# EAGLE design working (EAGLE 5.11)
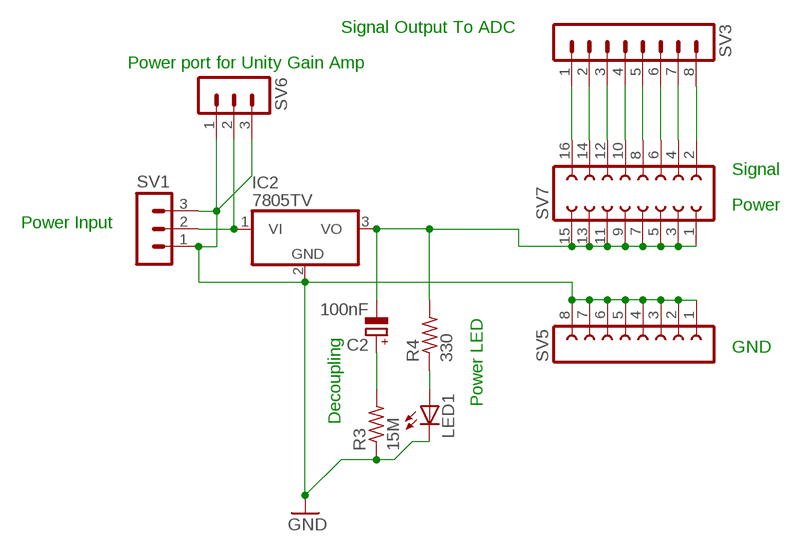
[diagram p0: schematic, sheet 1]

## Parts
C2  100nF  CPOL-EUE1.8-4  [E1,8-4]
IC2  7805TV  [TO220V]
LED1  LED5MM  [LED5MM]
R3  15M  R-US_0207/7  [0207/7]
R4  330  R-US_0207/7  [0207/7]
SV1  MA03-1  [MA03-1]
SV3  MA08-1  [MA08-1]
SV5  FE08-1  [FE08]
SV6  MA03-1  [MA03-1]
SV7  FE08-2  [FE08-2]

## Nets
GND: IC2.2(GND) LED1.K(C) R3.1 SV1.1 SV1.3 SV5.1 SV5.2 SV5.3 SV5.4 SV5.5 SV5.6 SV5.7 SV5.8 SV6.1 SV6.3
N$1: SV3.8 SV7.2
N$2: LED1.A R4.1
N$3: IC2.1(VI) SV1.2 SV6.2
N$4: C2.+ R3.2
N$5: SV3.1 SV7.16
N$6: SV3.2 SV7.14
N$7: SV3.3 SV7.12
N$8: SV3.4 SV7.10
N$9: SV3.5 SV7.8
N$10: SV3.6 SV7.6
N$11: SV3.7 SV7.4
N$13: C2.- IC2.3(VO) R4.2 SV7.1 SV7.3 SV7.5 SV7.7 SV7.9 SV7.11 SV7.13 SV7.15

## Notes on the sheet
- Signal Output To ADC
- Power port for Unity Gain Amp
- Signal
- Power
- Power Input
- GND
- Power LED
- Decoupling

## Library data of the parts
C2 = rcl:CPOL-EU: POLARIZED CAPACITOR, European symbol
IC2 = linear:78*: Positive VOLTAGE REGULATOR Source: http://cache.national.com/ds/LM/LM78L05.pdf http://www.fairchildsemi.com/ds/LM/LM7805.pdf
LED1 = led:LED: LED OSRAM: - CHIPLED LG R971, LG N971, LY N971, LG Q971, LY Q971, LO R971, LY R971 LH N974, LH R974 LS Q976, LO Q976, LY Q976 LO Q996 - Hyper CHIPLED LW Q18S LB Q993, LB Q99A, LB R99A - SideLED LS A670, LO A670, LY A670, LG A670, LP A670 LB A673, LV A673, LT A673, LW A673 LH A674 LY A675 LS A676, LA A676, LO A676, LY A676, LW A676 LS A679, LY A679, LG A679 - Hyper Micro SIDELED® LS Y876, LA Y876, LO Y876, LY Y876 LT Y87S - SmartLED LW L88C, LW L88S LB L89C, LB L89S, LG L890 LS L89K, LO L89K, LY L89K LS L896, LA L896, LO L896, LY L896 - TOPLED LS T670, LO T670, LY T670, LG T670, LP T670 LSG T670, LSP T670, LSY T670, LOP T670, LYG T670 LG T671, LOG T671, LSG T671 LB T673, LV T673, LT T673, LW T673 LH T674 LS T676, LA T676, LO T676, LY T676, LB T676, LH T676, LSB T676, LW T676 LB T67C, LV T67C, LT T67C, LS T67K, LO T67K, LY T67K, LW E67C LS E67B, LA E67B, LO E67B, LY E67B, LB E67C, LV E67C, LT E67C LW T67C LS T679, LY T679, LG T679 LS T770, LO T770, LY T770, LG T770, LP T770 LB T773, LV T773, LT T773, LW T773 LH T774 LS E675, LA E675, LY E675, LS T675 LS T776, LA T776, LO T776, LY T776, LB T776 LHGB T686 LT T68C, LB T68C - Hyper Mini TOPLED® LB M676 - Mini TOPLED Santana® LG M470 LS M47K, LO M47K, LY M47K Source: http://www.osram.convergy.de LUXEON: - LUMILED® LXK2-PW12-R00, LXK2-PW12-S00, LXK2-PW14-U00, LXK2-PW14-V00 LXK2-PM12-R00, LXK2-PM12-S00, LXK2-PM14-U00 LXK2-PE12-Q00, LXK2-PE12-R00, LXK2-PE12-S00, LXK2-PE14-T00, LXK2-PE14-U00 LXK2-PB12-K00, LXK2-PB12-L00, LXK2-PB12-M00, LXK2-PB14-N00, LXK2-PB14-P00, LXK2-PB14-Q00 LXK2-PR12-L00, LXK2-PR12-M00, LXK2-PR14-Q00, LXK2-PR14-R00 LXK2-PD12-Q00, LXK2-PD12-R00, LXK2-PD12-S00 LXK2-PH12-R00, LXK2-PH12-S00 LXK2-PL12-P00, LXK2-PL12-Q00, LXK2-PL12-R00 Source: www.luxeon.com KINGBRIGHT: KA-3528ASYC Source: www.kingbright.com
R3 R4 = resistor:R-US_: RESISTOR, American symbol
SV1 SV6 = con-lstb:MA03-1: PIN HEADER; OC_FARNELL: unknown; OC_NEWARK: unknown
SV3 = con-lstb:MA08-1: PIN HEADER; OC_FARNELL: unknown; OC_NEWARK: unknown
SV5 = con-lsta:FE08-1: FEMALE HEADER; OC_FARNELL: unknown; OC_NEWARK: unknown
SV7 = con-lsta:FE08-2: FEMALE HEADER; OC_FARNELL: unknown; OC_NEWARK: unknown

## Board
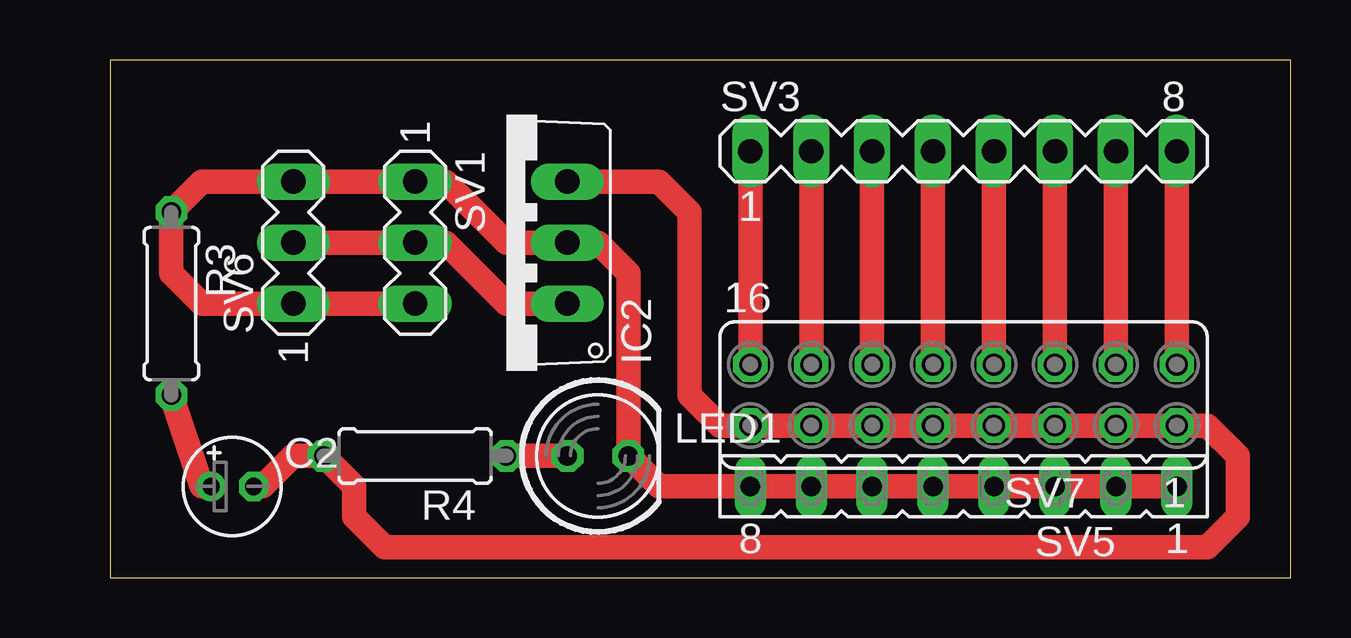
[diagram p1: board, top side]
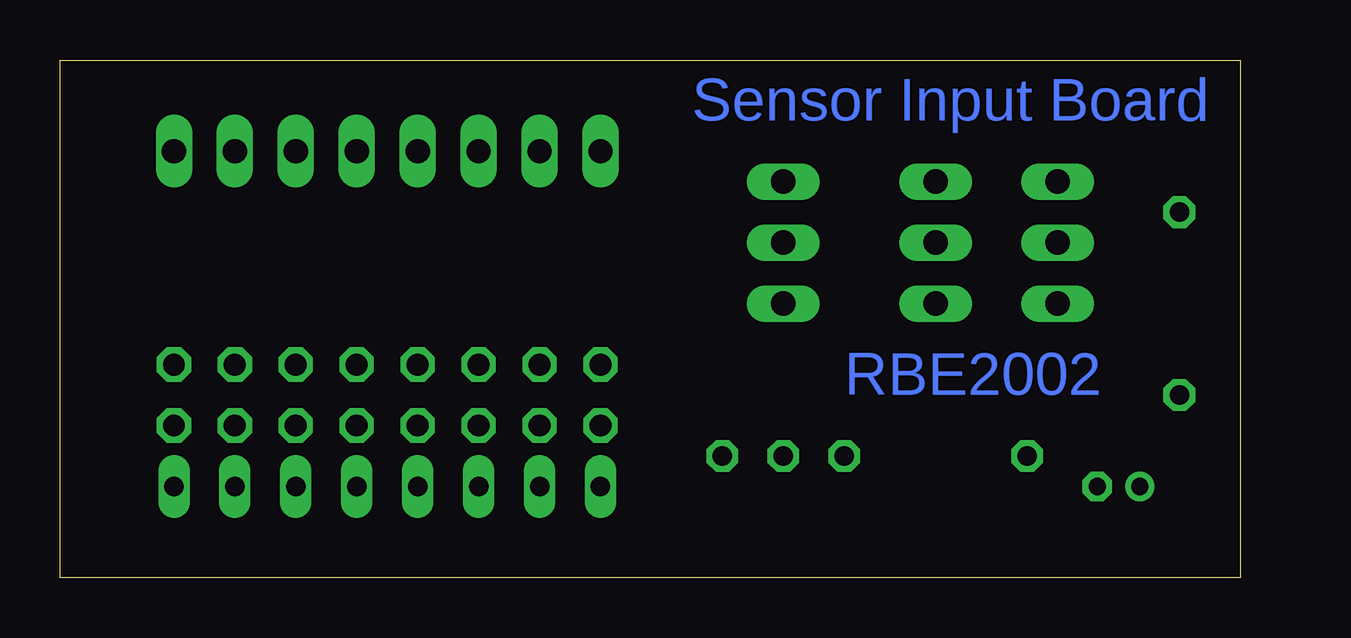
[diagram p2: board, bottom side, seen from below]

Size 49.2 x 21.58 mm. Coordinates in mm from the lower left corner, seen from the top.
Outline: 0,0 49.2,0 49.2,21.58 0,21.58 0,0
Copper layers (1*16): Top 0.035mm / dielectric 1.5mm / Bottom 0.035mm
Design rules "default": minimum track width 10mil, minimum drill 24mil, track to track 8mil, track to pad 8mil, pad to pad 8mil, via to via 8mil, smd to smd 8mil, copper to edge 40mil, drill to drill 8mil, minimum pad ring 10mil, minimum via ring 8mil, stop-mask expansion 4mil, vias tented up to drill 0mil, thermal gap 10mil

### Footprints (pad centres in the part's own frame; a part is rotated, then mirrored left to right if it is on the bottom)
E1,8-4 = drill 0.711 pad 1.168 round: + -0.889,0 | drill 0.711 pad 1.168 octagon: - 0.889,0
TO220V = drill 1.016 long: 1 -2.54,-2.54; 2 0,-2.54; 3 2.54,-2.54
LED5MM = drill 0.813 octagon: A -1.27,0; K 1.27,0
0207/7 = drill 0.813 octagon: 1 -3.81,0; 2 3.81,0
MA03-1 = drill 1.016 long: 1 -2.54,0; 2 0,0; 3 2.54,0
MA08-1 = drill 1.016 long: 1 -8.89,0; 2 -6.35,0; 3 -3.81,0; 4 -1.27,0; 5 1.27,0; 6 3.81,0; 7 6.35,0; 8 8.89,0
FE08 = drill 0.813 long: 1 -8.89,0; 2 -6.35,0; 3 -3.81,0; 4 -1.27,0; 5 1.27,0; 6 3.81,0; 7 6.35,0; 8 8.89,0
FE08-2 = drill 0.914 octagon: 1 -8.89,1.27; 2 -8.89,-1.27; 3 -6.35,1.27; 4 -6.35,-1.27; 5 -3.81,1.27; 6 -3.81,-1.27; 7 -1.27,1.27; 8 -1.27,-1.27; 9 1.27,1.27; 10 1.27,-1.27; 11 3.81,1.27; 12 3.81,-1.27; 13 6.35,1.27; 14 6.35,-1.27; 15 8.89,1.27; 16 8.89,-1.27

### Placement (x,y rotation side)
C2  5.08,3.81 0 top
IC2  16.51,13.97 90 top
LED1  20.32,5.08 0 top
R3  2.54,11.43 270 top
R4  12.7,5.08 180 top
SV1  12.7,13.97 270 top
SV3  35.56,17.78 0 top
SV5  35.56,3.81 180 top
SV6  7.62,13.97 90 top
SV7  35.56,7.62 180 top

### Tracks (layer width: path | path; a pad name or v marks a point on that pad's centre or on a via)
GND
  Top 1.016: SV5.1 SV5.2 SV5.3 SV5.4 SV5.5 SV5.6 SV5.7 SV5.8 22.86,3.81 LED1.K 21.59,12.7 20.32,13.97 IC2.2 16.51,13.97 13.97,16.51 SV1.1 SV6.3 3.81,16.51 R3.1 2.54,12.7 3.81,11.43 SV6.1 SV1.3
N$1
  Top 1.016: SV3.8 SV7.2
N$2
  Top 1.016: R4.1 LED1.A
N$3
  Top 1.016: SV6.2 SV1.2 13.97,13.97 16.51,11.43 IC2.1
N$4
  Top 1.016: C2.+ 3.81,3.81 R3.2
N$5
  Top 1.016: SV3.1 SV7.16
N$6
  Top 1.016: SV7.14 SV3.2
N$7
  Top 1.016: SV3.3 SV7.12
N$8
  Top 1.016: SV7.10 SV3.4
N$9
  Top 1.016: SV7.8 SV3.5
N$10
  Top 1.016: SV3.6 SV7.6
N$11
  Top 1.016: SV7.4 SV3.7
N$13
  Top 1.016: C2.- 6.35,3.81 7.62,5.08 R4.2 10.16,3.81 10.16,2.54 11.43,1.27 45.72,1.27 46.99,2.54 46.99,5.08 45.72,6.35 SV7.1 SV7.3 SV7.5 SV7.7 SV7.9 SV7.11 SV7.13 SV7.15 25.4,6.35 24.13,7.62 24.13,15.24 22.86,16.51 IC2.3

### Text on the board
Bottom: Sensor Input Board | RBE2002